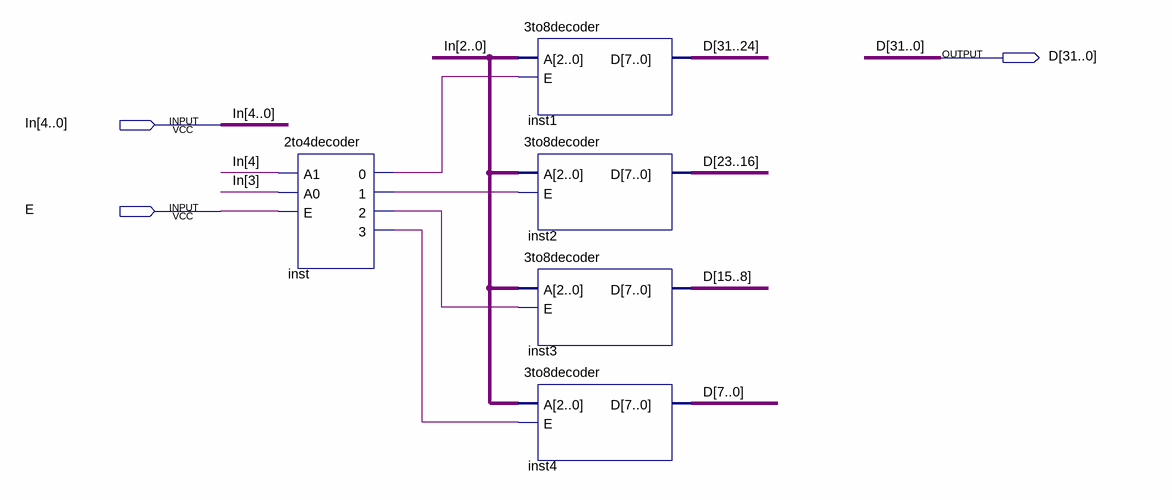
[diagram p0: schematic sheet]
// Quartus schematic 5to32decoder.bdf as structural Verilog: 5 symbols, 3 pins
module \5to32decoder  (
  input  [4:0] In,
  input  E,
  output [31:0] D
);

  wire inst_0, inst_1, inst_2, inst_3;

  \2to4decoder  inst (.A1(In[4]), .A0(In[3]), .E(E), .\0 (inst_0), .\1 (inst_1), .\2 (inst_2), .\3 (inst_3));
  \3to8decoder  inst1 (.A(In[2:0]), .E(inst_0), .D(D[31:24]));
  \3to8decoder  inst2 (.A(In[2:0]), .E(inst_1), .D(D[23:16]));
  \3to8decoder  inst3 (.A(In[2:0]), .E(inst_2), .D(D[15:8]));
  \3to8decoder  inst4 (.A(In[2:0]), .E(inst_3), .D(D[7:0]));
endmodule
